# Altium schematic sheet DB15F.SchDoc
size A4
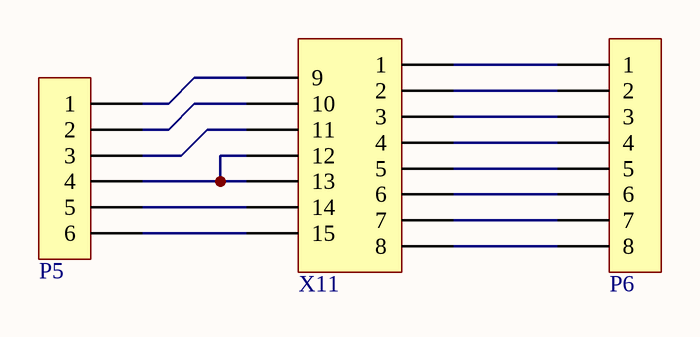
[diagram p0: DB15F.SchDoc]

## Parts
P5  SIL-CONN-6  [SIL-CONN-6-R1]  (value not drawn)
P6  SIL-CONN-8  [SIL-CONN-8-R1]  (value not drawn)
X11  DB-15  [DB15F]  (value not drawn)

## Nets
NetP5_1: P5.1 X11.9
NetP5_2: P5.2 X11.10
NetP5_3: P5.3 X11.11
NetP5_4: P5.4 X11.12 X11.13
NetP5_5: P5.5 X11.14
NetP5_6: P5.6 X11.15
NetP6_1: P6.1 X11.1
NetP6_2: P6.2 X11.2
NetP6_3: P6.3 X11.3
NetP6_4: P6.4 X11.4
NetP6_5: P6.5 X11.5
NetP6_6: P6.6 X11.6
NetP6_7: P6.7 X11.7
NetP6_8: P6.8 X11.8